# EAGLE design FORCE_SENSOR (EAGLE 7.1.0)
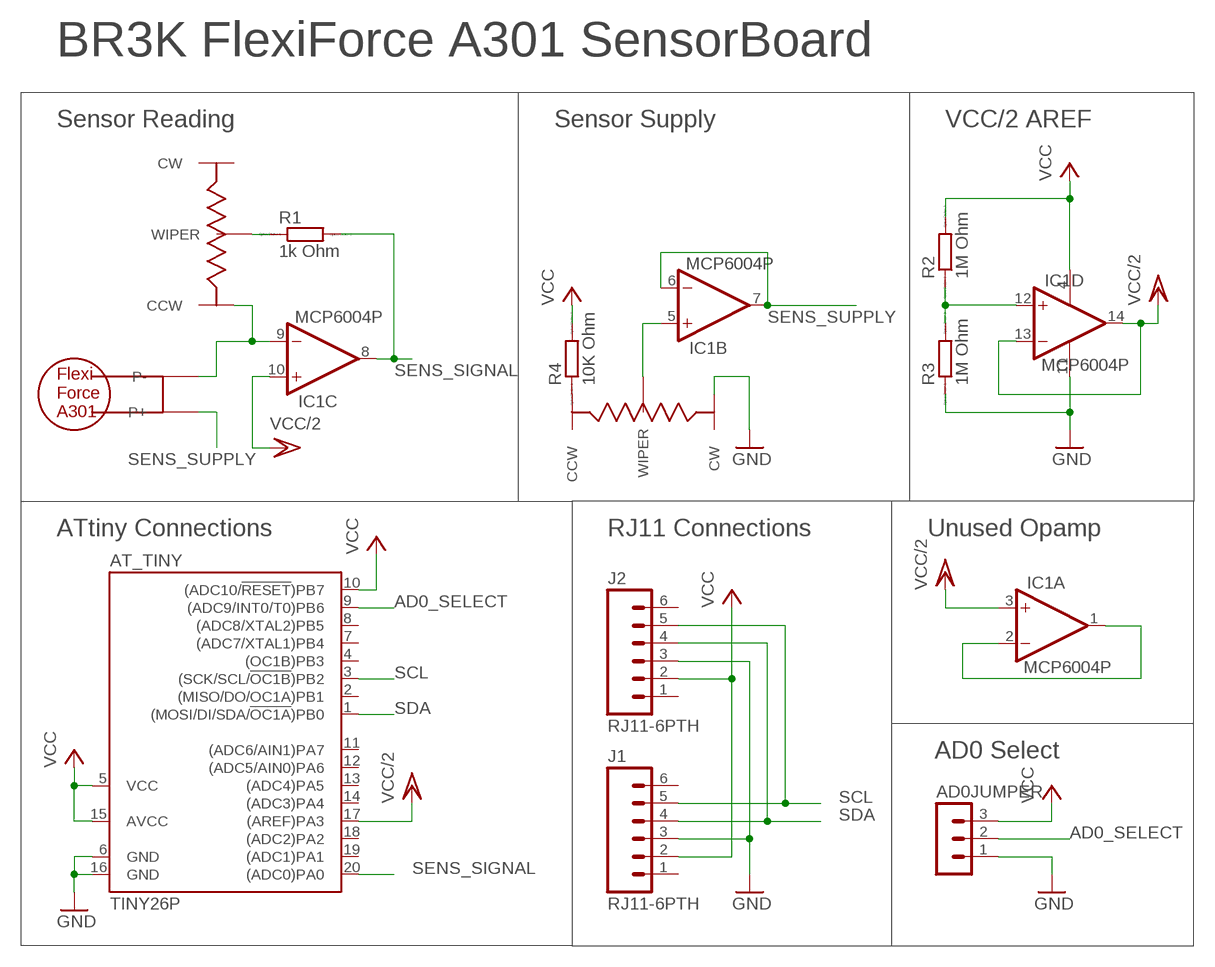
[diagram p0: schematic, sheet 1]

## Parts
AD0JUMPER  MA03-1  [MA03-1]
AT_TINY  TINY26P  [DIL20]
IC1  MCP6004P  [DIL14]
J1  RJ11-6PTH  [RJ11-6]
J2  RJ11-6PTH  [RJ11-6]
R1  1k Ohm  R-EU_0207_10  [0207/10]
R2  1M Ohm  R-EU_0207_10  [0207/10]
R3  1M Ohm  R-EU_0207_10  [0207/10]
R4  10K Ohm  R-EU_0207_10  [0207/10]
U$1  FLEXI_FORCE_A301  [FLEXIFORCE_W237-102]
U$2  100k Ohm  TRIMMER_3296  [VERT_TRIMPOT]
U$3  10k Ohm  TRIMMER_3296  [VERT_TRIMPOT]

## Nets
AD0_SELECT: AD0JUMPER.2 AT_TINY.9((ADC9/INT0/T0)PB6)
GND: AD0JUMPER.1 AT_TINY.6(GND) AT_TINY.16(GND) IC1.11(P:V-) J1.3 J2.3 R3.1 U$3.CW
N$1: R4.1 U$3.CCW
N$2: IC1.12(D:+IN) R2.1 R3.2
N$3: IC1.5(B:+IN) U$3.WIP(WIPER)
N$4: R1.1 U$2.WIP(WIPER)
N$5: IC1.9(C:-IN) U$1.2(P-) U$2.CCW
N$6: IC1.1(A:OUT) IC1.2(A:-IN)
SCL: AT_TINY.3((SCK/SCL/!OC1B!)PB2) J1.5 J2.5
SDA: AT_TINY.1((MOSI/DI/SDA/!OC1A!)PB0) J1.4 J2.4
SENS_SIGNAL: AT_TINY.20((ADC0)PA0) IC1.8(C:OUT) R1.2
SENS_SUPPLY: IC1.6(B:-IN) IC1.7(B:OUT) U$1.1(P+)
VCC: AD0JUMPER.3 AT_TINY.5(VCC) AT_TINY.10((ADC10/!RESET!)PB7) AT_TINY.15(AVCC) IC1.4(P:V+) J1.2 J2.2 R2.2 R4.2
VCC/2: AT_TINY.17((AREF)PA3) IC1.3(A:+IN) IC1.10(C:+IN) IC1.13(D:-IN) IC1.14(D:OUT)
Unconnected: AT_TINY.2((MISO/DO/OC1A)PB1) AT_TINY.4((OC1B)PB3) AT_TINY.7((ADC7/XTAL1)PB4) AT_TINY.8((ADC8/XTAL2)PB5) AT_TINY.11((ADC6/AIN1)PA7) AT_TINY.12((ADC5/AIN0)PA6) AT_TINY.13((ADC4)PA5) AT_TINY.14((ADC3)PA4) AT_TINY.18((ADC2)PA2) AT_TINY.19((ADC1)PA1) J1.1 J1.6 J2.1 J2.6 U$2.CW

## Notes on the sheet
- BR3K FlexiForce A301 SensorBoard
- Sensor Reading | Sensor Supply | VCC/2 AREF
- ATtiny Connections | RJ11 Connections | Unused Opamp
- AD0 Select

## Library data of the parts
AD0JUMPER = con-lstb:MA03-1: PIN HEADER; OC_FARNELL: unknown; OC_NEWARK: unknown
AT_TINY = atmel:TINY26*: 8-bit AVR Microcontroller with 2K Bytes Flash Source: http://www.atmel.com .. doc1477.pdf; MPN: ATTINY261-20PU; OC_FARNELL: 1455146; OC_NEWARK: 58M3782
IC1 = BodyRockParts:MCP6004: Quad Op Amp 1.8V to 6.0V Single Supply CMOS Source: http://ww1.microchip.com/downloads/en/DeviceDoc/21733j.pdf
J1 J2 = BodyRockParts:RJ11-6: RJ11 Jack Simple 6 pin RJ11 jack. Commonly found on CAT3 devices and Microchip programmers. SKU: PRT-00132
R1-R4 = resistor:R-EU_: RESISTOR, European symbol; SPICEPREFIX: R
U$1 = BodyRockParts:FLEXI_FORCE_A301: Flexiforce A301 connected through a screw terminal
U$2 U$3 = BodyRockParts:TRIMMER_3296: TRIMMER 3296 25 turn vertical precision potmeter

## Board
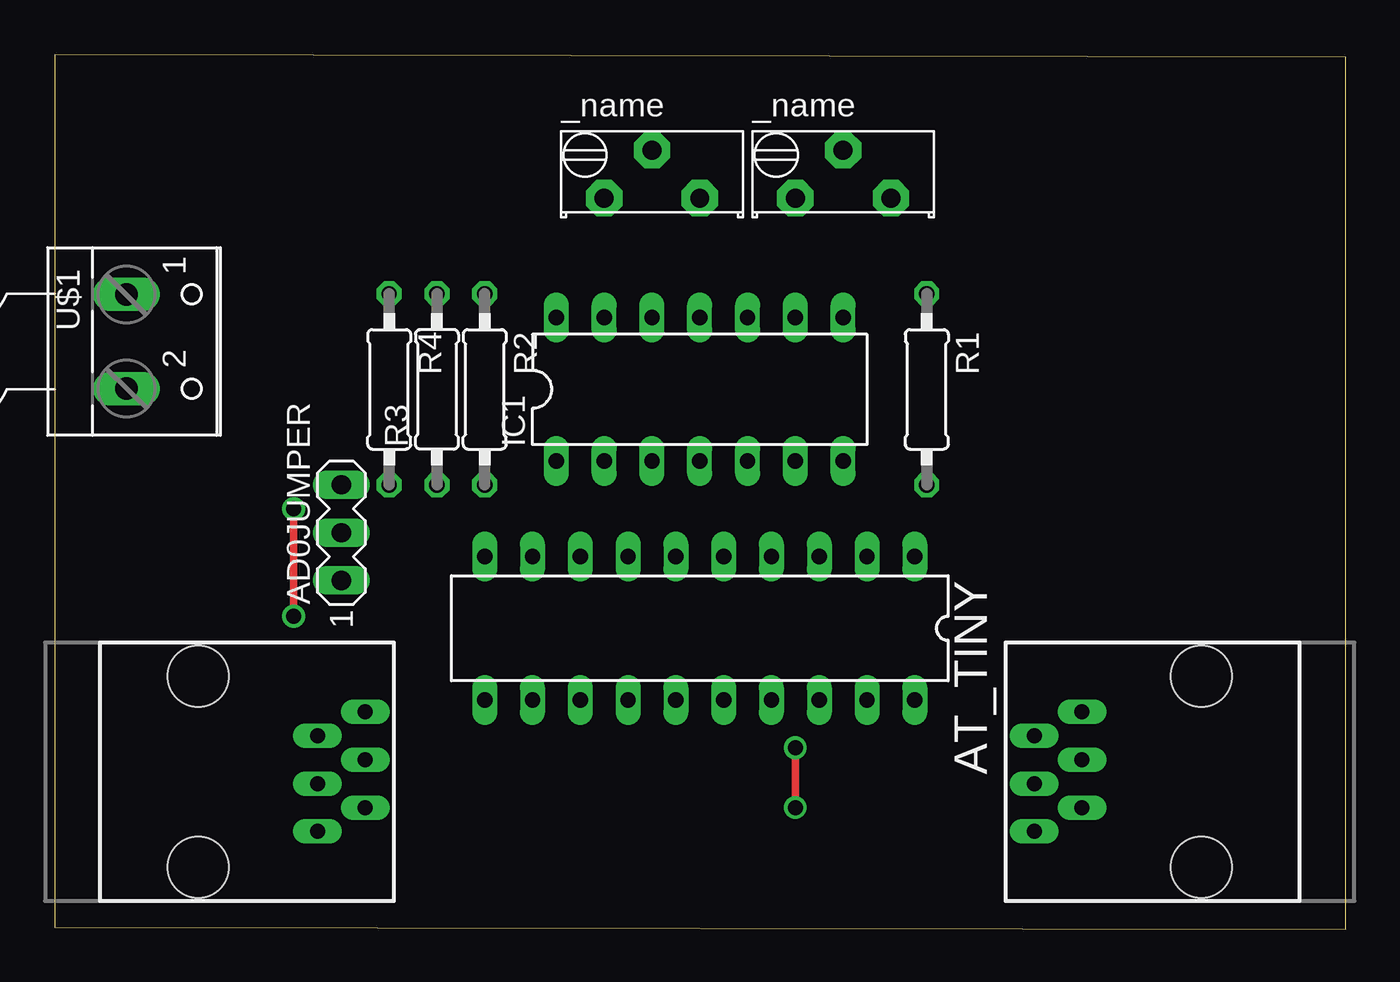
[diagram p1: board, top side]
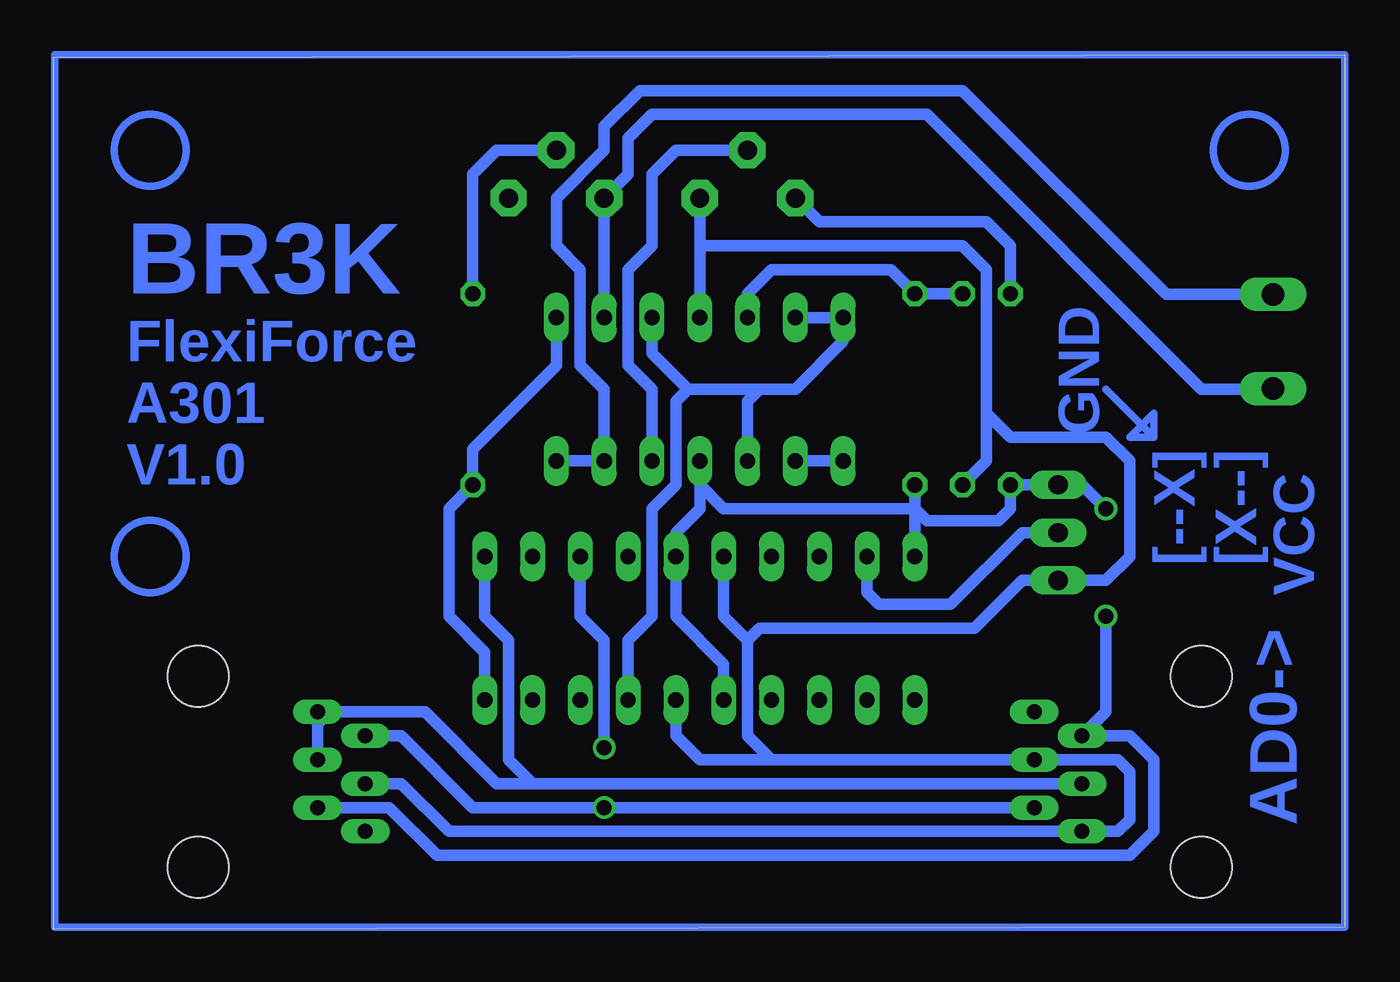
[diagram p2: board, bottom side, seen from below]

Size 68.63 x 46.47 mm. Coordinates in mm from the lower left corner, seen from the top.
Outline: 0,0.13 68.63,0 68.63,46.34 0,46.47 0,0.13
Copper layers (1*16): Top 0.035mm / dielectric 1.5mm / Bottom 0.035mm
Design rules "default *": minimum track width 10mil, minimum drill 24mil, track to track 12mil, track to pad 12mil, pad to pad 12mil, via to via 12mil, smd to smd 12mil, copper to edge 40mil, drill to drill 8mil, minimum pad ring 10mil, minimum via ring 8mil, stop-mask expansion 4mil, vias tented up to drill 0mil, thermal gap 10mil

### Footprints (pad centres in the part's own frame; a part is rotated, then mirrored left to right if it is on the bottom)
MA03-1 = drill 1.016 long: 1 -2.54,0; 2 0,0; 3 2.54,0
DIL20 = drill 0.813 long: 1 -11.43,-3.81; 2 -8.89,-3.81; 3 -6.35,-3.81; 4 -3.81,-3.81; 5 -1.27,-3.81; 6 1.27,-3.81; 7 3.81,-3.81; 8 6.35,-3.81; 9 8.89,-3.81; 10 11.43,-3.81; 11 11.43,3.81; 12 8.89,3.81; 13 6.35,3.81; 14 3.81,3.81; 15 1.27,3.81; 16 -1.27,3.81; 17 -3.81,3.81; 18 -6.35,3.81; 19 -8.89,3.81; 20 -11.43,3.81
DIL14 = drill 0.813 long: 1 -7.62,-3.81; 2 -5.08,-3.81; 3 -2.54,-3.81; 4 0,-3.81; 5 2.54,-3.81; 6 5.08,-3.81; 7 7.62,-3.81; 8 7.62,3.81; 9 5.08,3.81; 10 2.54,3.81; 11 0,3.81; 12 -2.54,3.81; 13 -5.08,3.81; 14 -7.62,3.81
RJ11-6 = drill 0.8 long: 1 1.905,8.89; 2 3.175,6.35; 3 4.445,8.89; 4 5.715,6.35; 5 6.985,8.89; 6 8.255,6.35 | hole 3.251: 0,0; 10.16,0
0207/10 = drill 0.813 octagon: 1 -5.08,0; 2 5.08,0
FLEXIFORCE_W237-102 = drill 1.194 long: 1 -2.5,-1.27; 2 2.5,-1.27
VERT_TRIMPOT = drill 1 pad 1.93 octagon: CCW 0,0; CW 5.08,0; WIP 2.54,2.54

### Placement (x,y rotation side)
AD0JUMPER  15.24,21.08 90 top
AT_TINY  34.29,16 180 top
IC1  34.29,28.7 0 top
J1  7.62,13.46 270 top
J2  60.96,3.3 90 top
R1  46.36,28.7 270 top
R2  22.86,28.7 270 top
R3  20.32,28.7 90 top
R4  17.78,28.7 270 top
U$1  5.08,31.24 270 top
U$2  39.37,38.86 0 top
U$3  29.21,38.86 0 top

### Tracks (layer width: path | path; a pad name or v marks a point on that pad's centre or on a via)
AD0_SELECT
  Bottom 0.61: AT_TINY.9 25.4,17.91 24.77,17.27 20.96,17.27 17.14,21.08 AD0JUMPER.2
GND
  Bottom 0.61: R3.1 19.05,24.89 19.05,27.43 | 19.05,27.43 19.05,35.05 20.32,36.32 34.29,36.32 | U$3.CW 34.29,36.32 | 34.29,36.32 IC1.11 | AT_TINY.16 35.56,10.29 34.29,9.02 30.48,9.02 | 19.05,27.43 17.78,26.16 12.7,26.16 11.43,24.89 11.43,19.81 12.7,18.54 AD0JUMPER.1 17.14,18.54 19.69,16 31.12,16 31.75,15.37 | 31.75,15.37 31.75,10.29 30.48,9.02 | J2.3 50.16,7.75 47.62,5.21 12.07,5.21 11.43,5.84 11.43,8.38 12.07,9.02 J1.3 30.48,9.02 | AT_TINY.6 33.02,16.64 31.75,15.37
N$1
  Bottom 0.61: R4.1 17.78,36.32 19.05,37.59 27.94,37.59 U$3.CCW
N$2
  Bottom 0.61: R3.2 R2.1 24.13,35.05 30.48,35.05 31.75,33.78 IC1.12
N$3
  Bottom 0.61: IC1.5 36.83,28.7 38.1,29.97 38.1,35.05 36.83,36.32 36.83,40.13 35.56,41.4 U$3.WIP
N$4
  Bottom 0.61: R1.1 46.36,40.13 45.09,41.4 U$2.WIP
N$5
  Bottom 0.406: 3.81,28.7 U$1.2
  Bottom 0.61: IC1.9 U$2.CCW 38.1,40.13 38.1,42.04 36.83,43.31 22.23,43.31 7.62,28.7 5.08,28.7 | 5.04,28.74 5.08,28.7 | 3.81,28.7 5.08,28.7
N$6
  Bottom 0.61: IC1.2 IC1.1
N$7
  Bottom 0.406: 0,46.48 0,0.13 68.58,0.13 68.58,46.48 0,46.48
N$8
  Bottom 0.406: 12.7,28.7 10.16,26.16 | 10.16,26.16 11.43,26.16 10.16,27.43 10.16,26.16
SCL  (via drill 0.8)
  Top 0.406: v39.37,9.65 v39.37,6.48
  Bottom 0.61: J2.5 50.16,10.29 46.36,6.48 v39.37,6.48 J1.5 | AT_TINY.3 40.64,16.64 39.37,15.37 v39.37,9.65
SDA
  Bottom 0.61: J1.4 43.18,7.75 | 43.18,7.75 45.09,7.75 48.9,11.56 53.98,11.56 54.61,10.92 J2.4 | AT_TINY.1 45.72,16.64 44.45,15.37 44.45,9.02 43.18,7.75
SENS_SIGNAL
  Bottom 0.61: IC1.8 41.91,29.97 46.36,25.53 R1.2 47.62,22.35 47.62,16.64 45.72,14.73 AT_TINY.20
SENS_SUPPLY
  Bottom 0.61: IC1.7 IC1.6 39.37,28.7 40.64,29.97 40.64,35.05 41.91,36.32 41.91,38.86 39.37,41.4 39.37,42.67 37.47,44.58 20.32,44.58 9.48,33.74 U$1.1
VCC  (via drill 0.8)
  Top 0.406: v12.7,16.64 v12.7,22.35
  Bottom 0.61: 22.86,22.35 22.23,21.72 18.41,21.72 17.78,22.35 R4.2 AD0JUMPER.3 13.97,23.62 v12.7,22.35 | 22.86,22.35 R2.2 | 22.86,22.35 33.02,22.35 34.29,23.62 IC1.4 34.29,22.35 35.56,21.08 AT_TINY.5 35.56,16.64 33.02,14.1 AT_TINY.15 | AT_TINY.10 22.86,22.35 | J2.2 50.8,6.48 48.26,3.94 11.43,3.94 10.16,5.21 10.16,9.02 11.43,10.29 J1.2 12.7,11.56 v12.7,16.64
VCC/2
  Bottom 0.61: IC1.3 31.75,28.07 31.12,28.7 | 34.93,28.7 35.56,28.07 35.56,23.62 36.83,22.35 36.83,16.64 38.1,15.37 AT_TINY.17 | 34.93,28.7 31.12,28.7 | 34.93,28.7 36.83,30.61 IC1.10 | IC1.13 IC1.14 26.67,31.24 29.21,28.7 31.12,28.7
(copper drawn outside any net)
  shapes: Bottom circle x7

### Text on the board
Bottom: GND | BR3K | [--X] / [X--] | VCC | FlexiForce / A301 / V1.0 | AD0->